# EAGLE design CSPB (EAGLE 9.5.1)

## Sheet 1 of 2
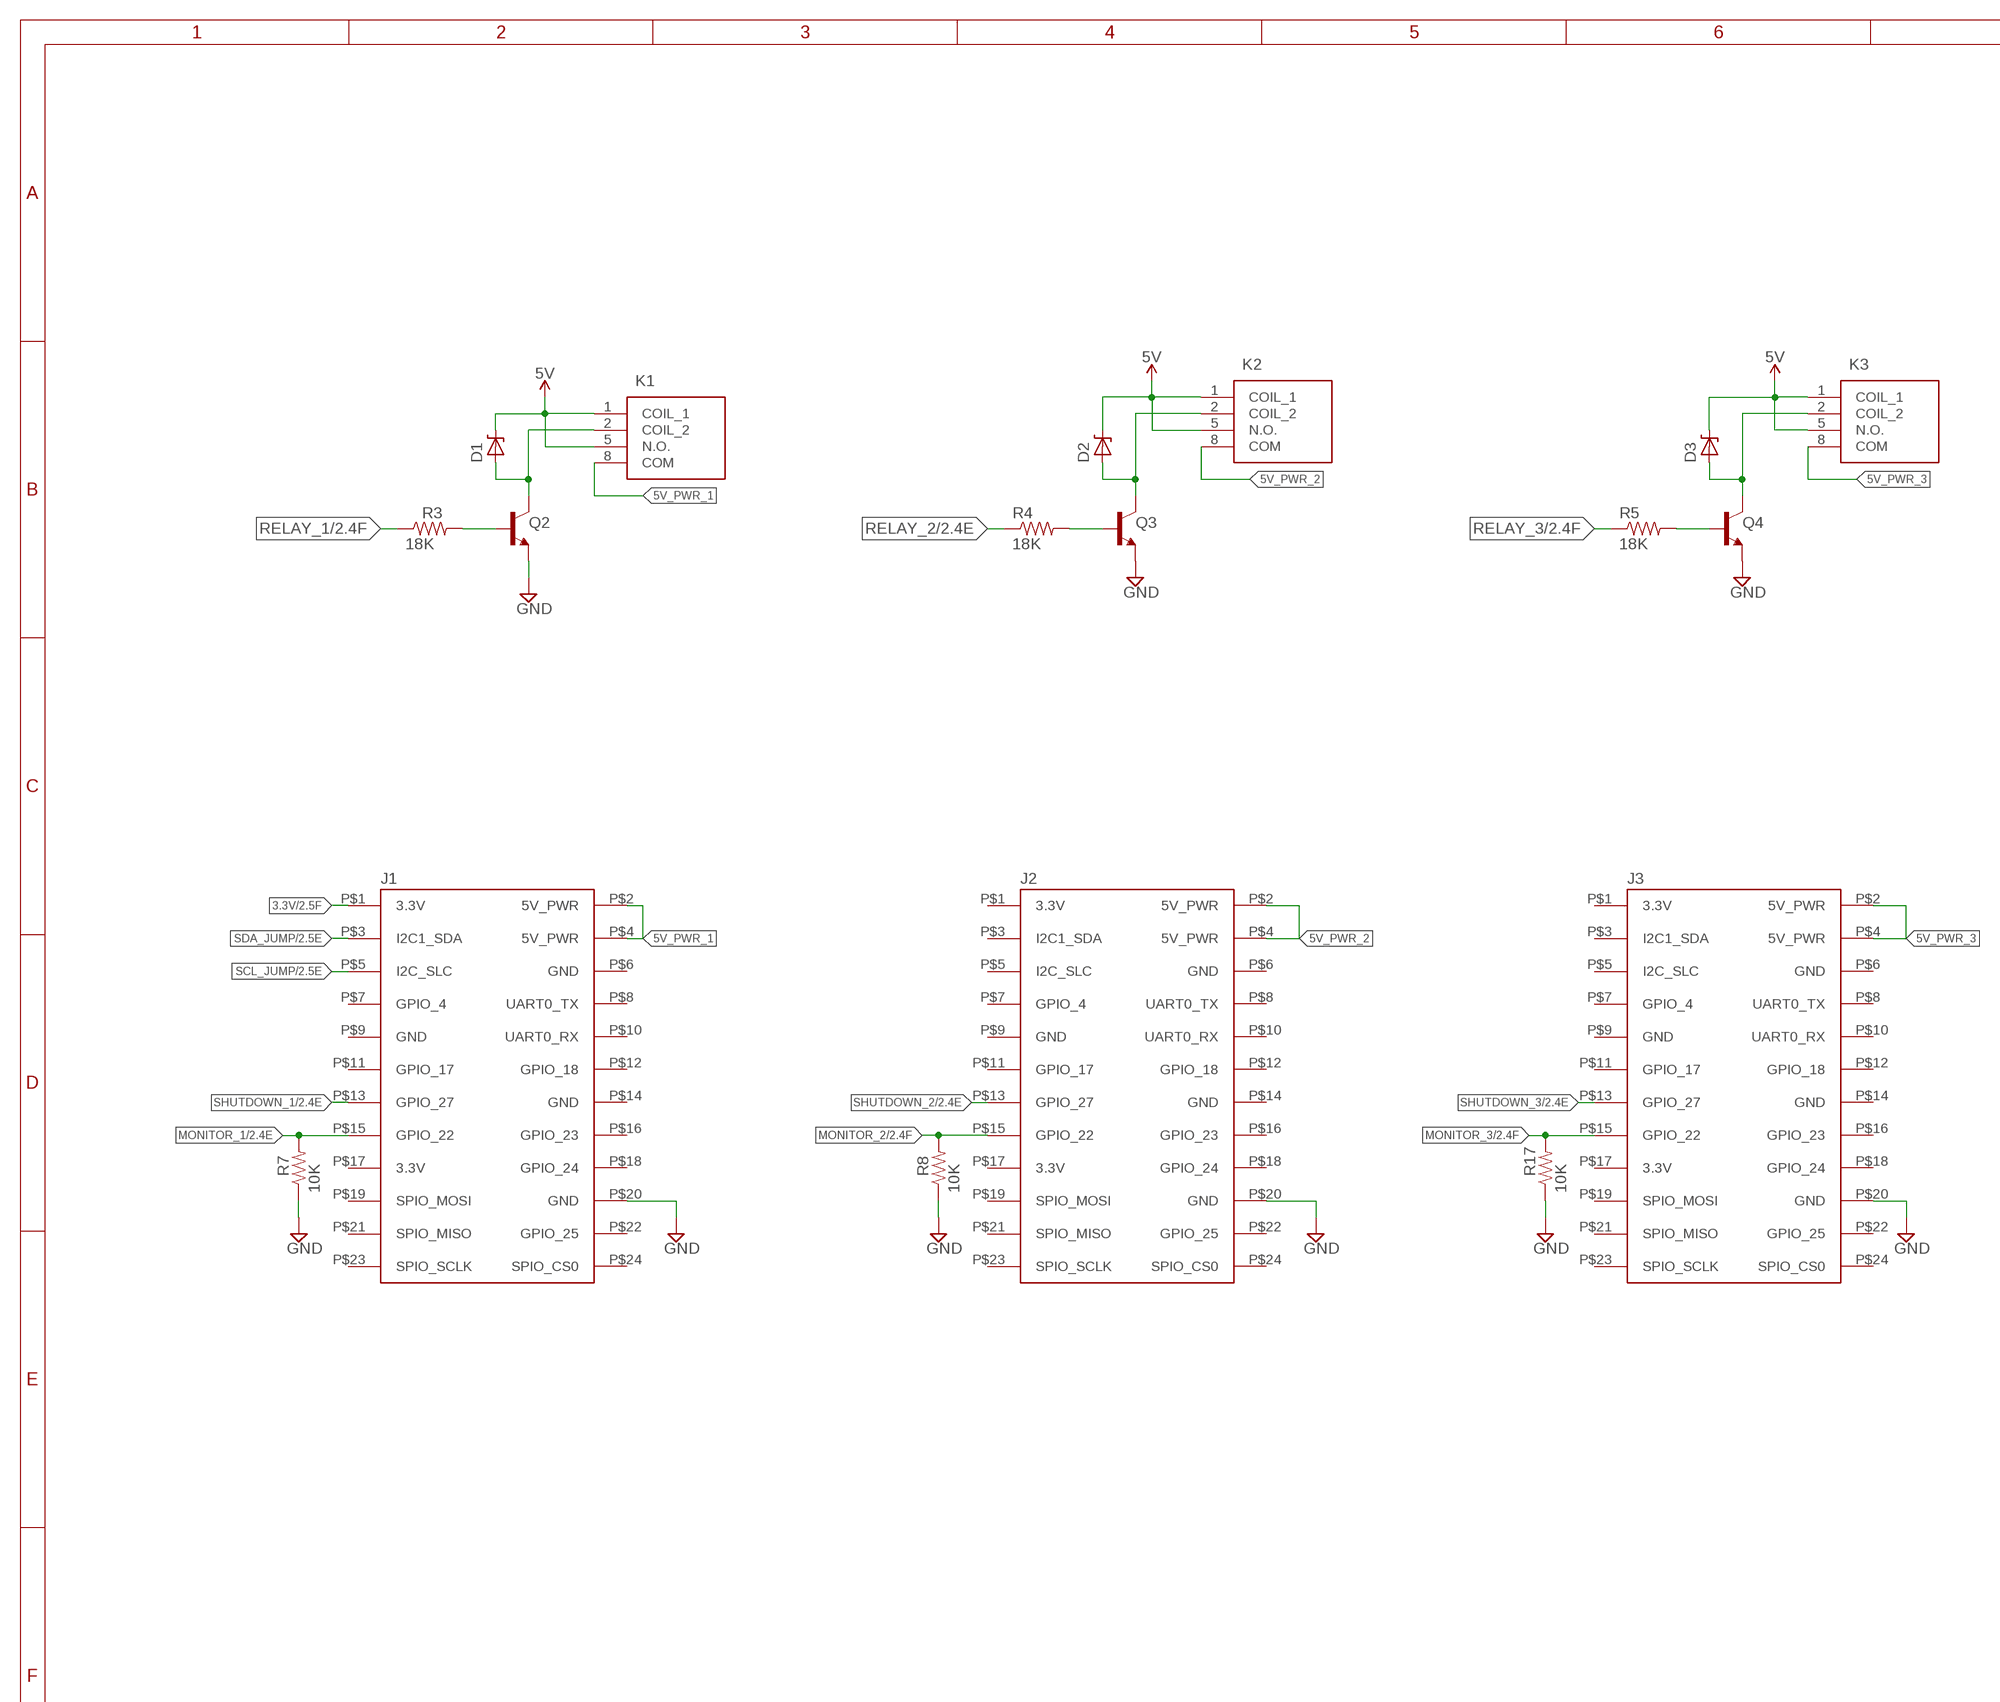
[diagram p0: schematic, sheet 1, part 1 of 2]
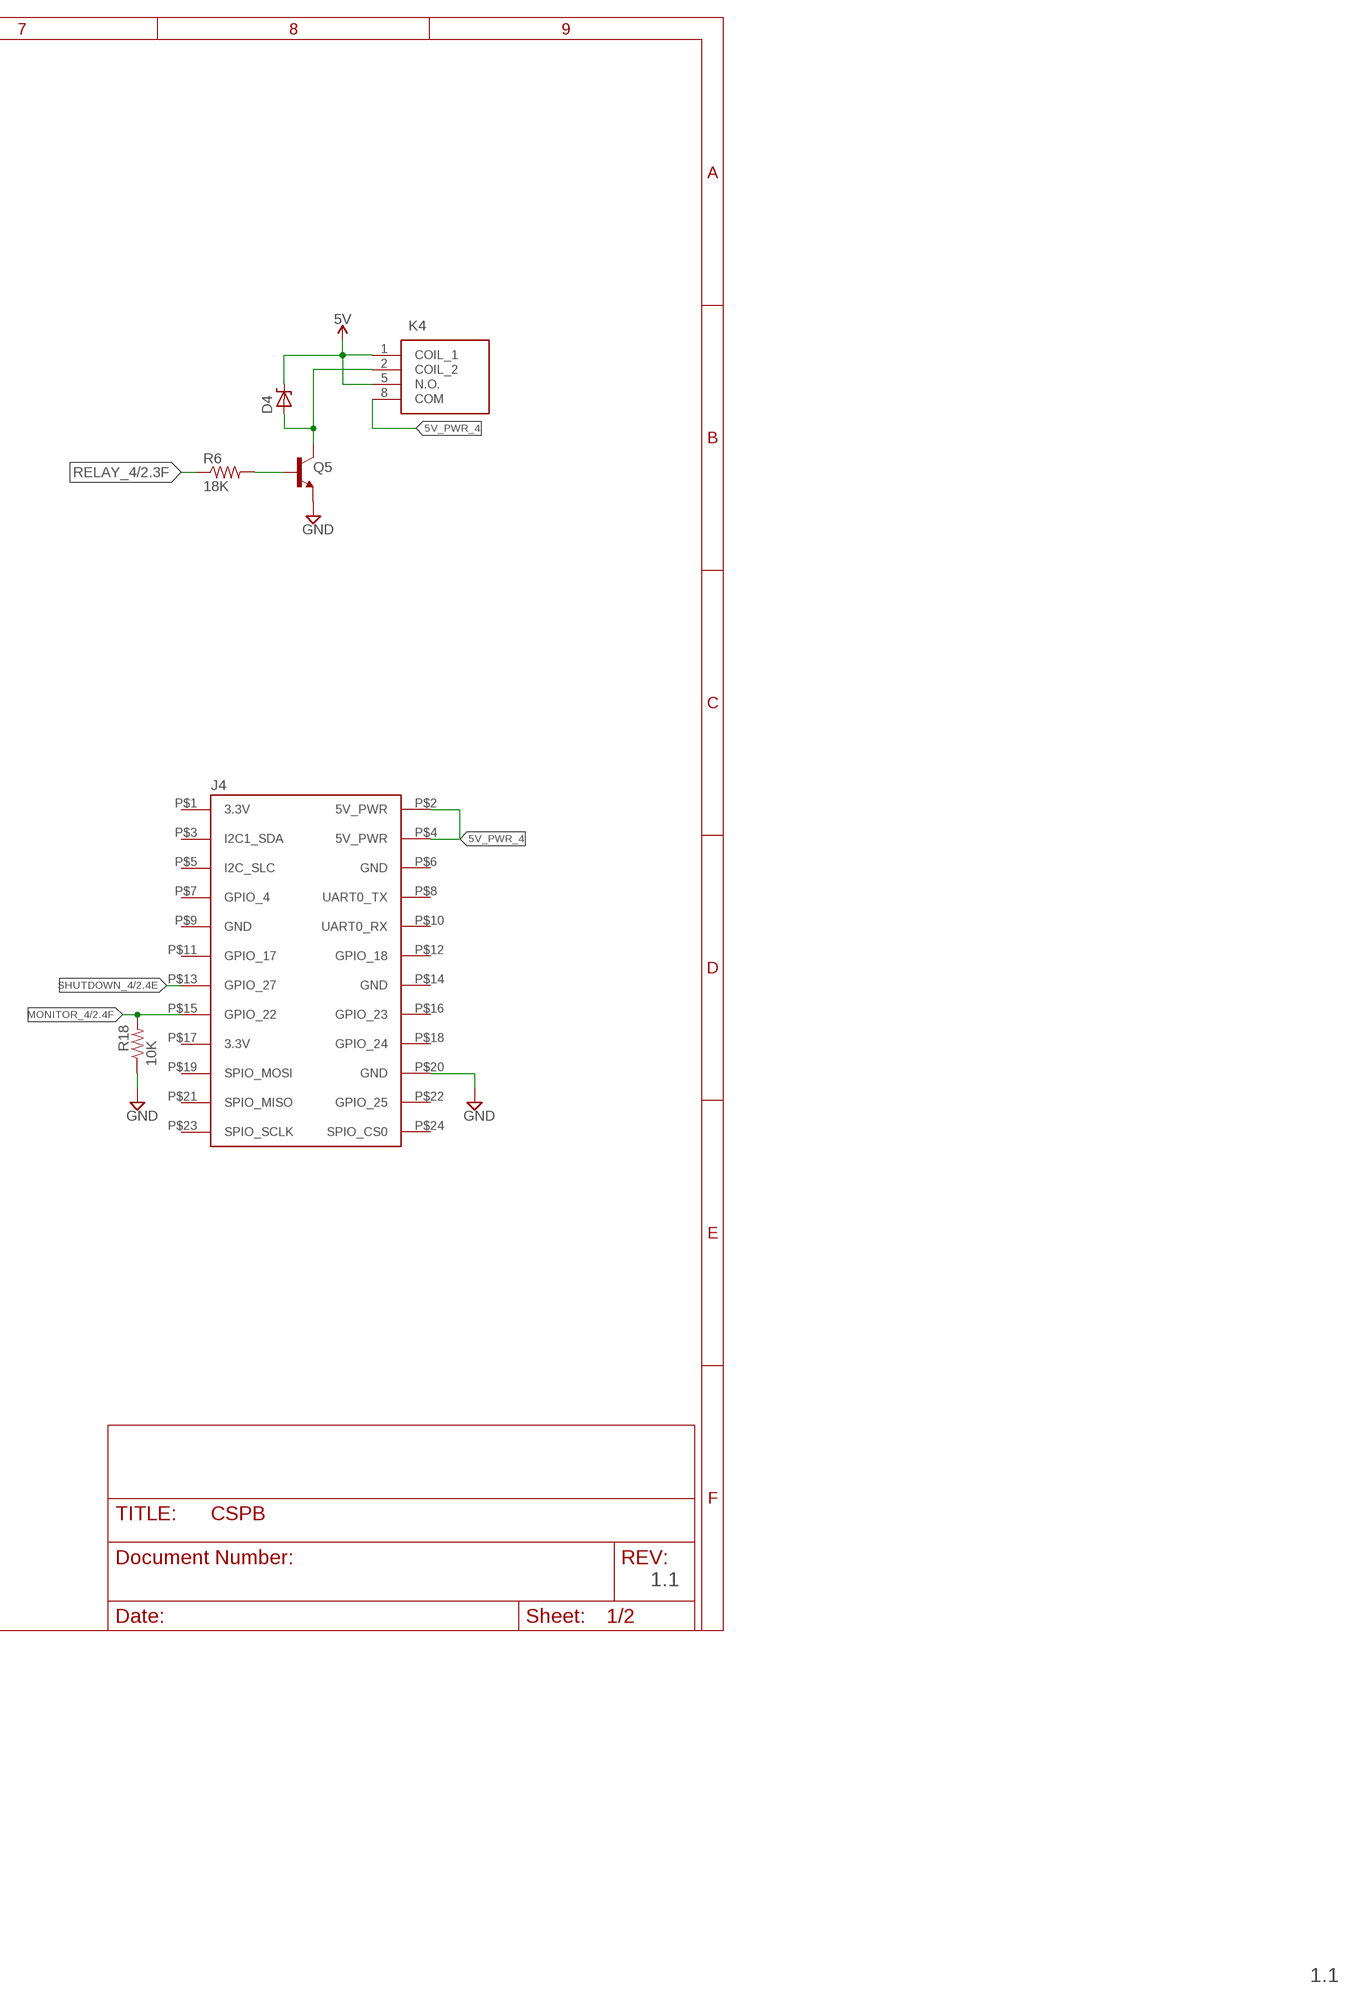
[diagram p1: schematic, sheet 1, part 2 of 2]

### Parts
D1  1A/23V/620mV  DIODE-ZENER  [SMADIODE]
D2  1A/23V/620mV  DIODE-ZENER  [SMADIODE]
D3  1A/23V/620mV  DIODE-ZENER  [SMADIODE]
D4  1A/23V/620mV  DIODE-ZENER  [SMADIODE]
J1  5530843-1  [2X12_TH_EDGE_CONN]
J2  5530843-1  [2X12_TH_EDGE_CONN]
J3  5530843-1  [2X12_TH_EDGE_CONN]
J4  5530843-1  [2X12_TH_EDGE_CONN]
K1  G6DN-1A_DC5  [G6DN-1A-L]
K2  G6DN-1A_DC5  [G6DN-1A-L]
K3  G6DN-1A_DC5  [G6DN-1A-L]
K4  G6DN-1A_DC5  [G6DN-1A-L]
Q2  600mA/40V  TRANS_NPN-MMBT2222AL  [SOT23-3]
Q3  600mA/40V  TRANS_NPN-MMBT2222AL  [SOT23-3]
Q4  600mA/40V  TRANS_NPN-MMBT2222AL  [SOT23-3]
Q5  600mA/40V  TRANS_NPN-MMBT2222AL  [SOT23-3]
R3  18K  RESISTOR0603-RES  [0603-RES]
R4  18K  RESISTOR0603-RES  [0603-RES]
R5  18K  RESISTOR0603-RES  [0603-RES]
R6  18K  RESISTOR0603-RES  [0603-RES]
R7  10K  RESISTOR0603-RES  [0603-RES]
R8  10K  RESISTOR0603-RES  [0603-RES]
R17  10K  RESISTOR0603-RES  [0603-RES]
R18  10K  RESISTOR0603-RES  [0603-RES]

### Nets
3.3V: J1.P$1(3.3V) ; also sheet 2
5V: D1.C D2.C D3.C D4.C K1.1(COIL_1) K1.5(N.O.) K2.1(COIL_1) K2.5(N.O.) K3.1(COIL_1) K3.5(N.O.) K4.1(COIL_1) K4.5(N.O.) ; also sheet 2
5V_PWR_1: J1.P$2(5V_PWR) J1.P$4(5V_PWR) K1.8(COM)
5V_PWR_2: J2.P$2(5V_PWR) J2.P$4(5V_PWR) K2.8(COM)
5V_PWR_3: J3.P$2(5V_PWR) J3.P$4(5V_PWR) K3.8(COM)
5V_PWR_4: J4.P$2(5V_PWR) J4.P$4(5V_PWR) K4.8(COM)
GND: J1.P$20(GND) J2.P$20(GND) J3.P$20(GND) J4.P$20(GND) Q2.2(E) Q3.2(E) Q4.2(E) Q5.2(E) R7.1 R8.1 R17.1 R18.1 ; also sheet 2
MONITOR_1: J1.P$15(GPIO_22) R7.2 ; also sheet 2
MONITOR_2: J2.P$15(GPIO_22) R8.2 ; also sheet 2
MONITOR_3: J3.P$15(GPIO_22) R17.2 ; also sheet 2
MONITOR_4: J4.P$15(GPIO_22) R18.2 ; also sheet 2
N$3: Q2.1(B) R3.2
N$4: D1.A K1.2(COIL_2) Q2.3(C)
N$5: Q4.1(B) R5.2
N$8: Q5.1(B) R6.2
N$16: D2.A K2.2(COIL_2) Q3.3(C)
N$21: D3.A K3.2(COIL_2) Q4.3(C)
N$22: D4.A K4.2(COIL_2) Q5.3(C)
N$35: Q3.1(B) R4.2
RELAY_1: R3.1 ; also sheet 2
RELAY_2: R4.1 ; also sheet 2
RELAY_3: R5.1 ; also sheet 2
RELAY_4: R6.1 ; also sheet 2
SCL_JUMP: J1.P$5(I2C_SLC) ; also sheet 2
SDA_JUMP: J1.P$3(I2C1_SDA) ; also sheet 2
SHUTDOWN_1: J1.P$13(GPIO_27) ; also sheet 2
SHUTDOWN_2: J2.P$13(GPIO_27) ; also sheet 2
SHUTDOWN_3: J3.P$13(GPIO_27) ; also sheet 2
SHUTDOWN_4: J4.P$13(GPIO_27) ; also sheet 2
Unconnected: J1.P$7(GPIO_4) J1.P$8(UART0_TX) J1.P$10(UART0_RX) J1.P$11(GPIO_17) J1.P$12(GPIO_18) J1.P$16(GPIO_23) J1.P$17(3.3V) J1.P$18(GPIO_24) J1.P$19(SPIO_MOSI) J1.P$21(SPIO_MISO) J1.P$22(GPIO_25) J1.P$23(SPIO_SCLK) J1.P$24(SPIO_CS0) J2.P$1(3.3V) J2.P$3(I2C1_SDA) J2.P$5(I2C_SLC) J2.P$7(GPIO_4) J2.P$8(UART0_TX) J2.P$10(UART0_RX) J2.P$11(GPIO_17) J2.P$12(GPIO_18) J2.P$16(GPIO_23) J2.P$17(3.3V) J2.P$18(GPIO_24) J2.P$19(SPIO_MOSI) J2.P$21(SPIO_MISO) J2.P$22(GPIO_25) J2.P$23(SPIO_SCLK) J2.P$24(SPIO_CS0) J3.P$1(3.3V) J3.P$3(I2C1_SDA) J3.P$5(I2C_SLC) J3.P$7(GPIO_4) J3.P$8(UART0_TX) J3.P$10(UART0_RX) J3.P$11(GPIO_17) J3.P$12(GPIO_18) J3.P$16(GPIO_23) J3.P$17(3.3V) J3.P$18(GPIO_24) J3.P$19(SPIO_MOSI) J3.P$21(SPIO_MISO) J3.P$22(GPIO_25) J3.P$23(SPIO_SCLK) J3.P$24(SPIO_CS0) J4.P$1(3.3V) J4.P$3(I2C1_SDA) J4.P$5(I2C_SLC) J4.P$7(GPIO_4) J4.P$8(UART0_TX) J4.P$10(UART0_RX) J4.P$11(GPIO_17) J4.P$12(GPIO_18) J4.P$16(GPIO_23) J4.P$17(3.3V) J4.P$18(GPIO_24) J4.P$19(SPIO_MOSI) J4.P$21(SPIO_MISO) J4.P$22(GPIO_25) J4.P$23(SPIO_SCLK) J4.P$24(SPIO_CS0)

### Notes on the sheet
- 1.1
- 1.1

## Sheet 2 of 2
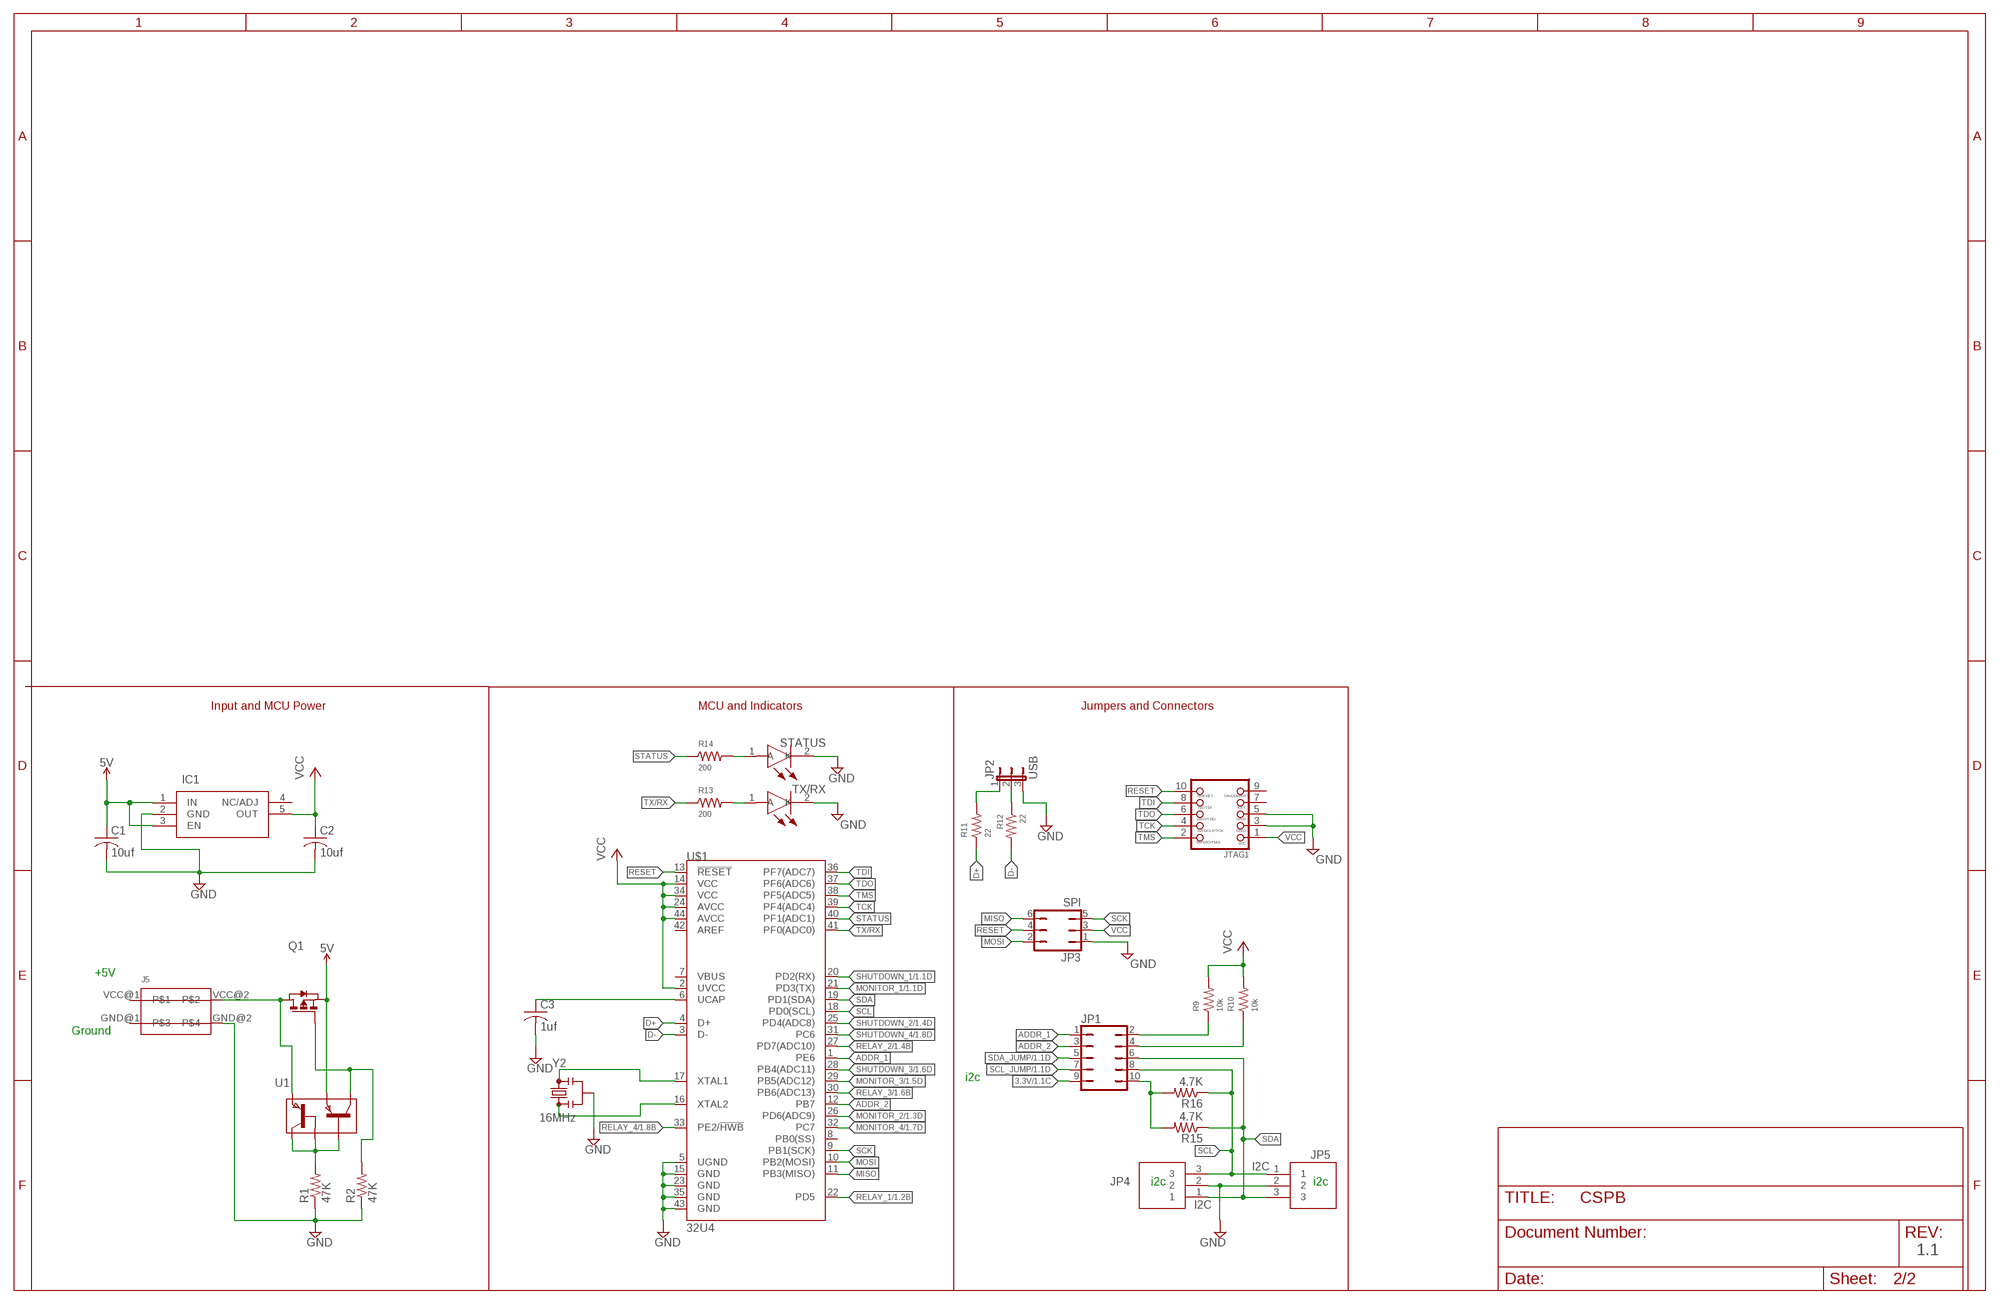
[diagram p2: schematic, sheet 2]

### Parts
C1  10uf  C-USC1206  [C1206]
C2  10uf  C-USC1206  [C1206]
C3  1uf  C-USC1206  [C1206]
IC1  MIC5225-5.0YM5-TR  [SOT95P280X130-5N]
J5  182442000  [TB-2-POS-3_5MM-PITCH]
JP1  JP5Q  [JP5Q]
JP2  USB  JUMPER3  [JUMPER3]
JP3  SPI  JP3Q  [JP3Q]
JP4  I2C  S3B-PH-K-S_LF__SN_  [SHDRRA3W50P0X200_1X3_790X760X4]
JP5  I2C  S3B-PH-K-S_LF__SN_  [SHDRRA3W50P0X200_1X3_790X760X4]
JTAG1  JTAG-CORTEXM3MOLEX  [CORTEXM3_SWD10_MOLEX]
Q1  SQM40081EL  [TO-263AB]
R1  47K  RESISTOR1206  [1206]
R2  47K  RESISTOR1206  [1206]
R9  10k  RESISTOR0402-RES  [0402-RES]
R10  10k  RESISTOR0402-RES  [0402-RES]
R11  22  RESISTOR0402-RES  [0402-RES]
R12  22  RESISTOR0402-RES  [0402-RES]
R13  200  RESISTOR0805-RES  [0805]
R14  200  RESISTOR0805-RES  [0805]
R15  4.7K  RESISTOR0603-RES  [0603-RES]
R16  4.7K  RESISTOR0603-RES  [0603-RES]
STATUS  LTST-S220KGKT  [LTSTS220KGKT]
TX/RX  LTST-S220KRKT  [LTSTS220KGKT]
U1  DMMT5401-7-F  [SOT26-PNP]
U$1  32U4  ATMEGA32U4QFN  [QFN-44]
Y2  16MHz  RESONATOR-16MHZSMD_3.2X1.3  [RESONATOR-SMD-3.2X1.3]

### Nets
3.3V: JP1.9 ; also sheet 1
5V: C1.1 IC1.1(IN) IC1.3(EN) Q1.3(S) U1.E2(E1) ; also sheet 1
ADDR_1: JP1.1 U$1.1(PE6)
ADDR_2: JP1.3 U$1.12(PB7)
D+: R11.1 U$1.4(D+)
D-: R12.2 U$1.3(D-)
GND: C1.2 C2.2 C3.2 IC1.2(GND) J5.GND@2 JP2.3 JP3.1 JP4.2 JP5.2 JTAG1.3 JTAG1.5 R1.1 R2.1 STATUS.2(K) TX/RX.2(K) U$1.5(UGND) U$1.15(GND) U$1.23(GND) U$1.35(GND) U$1.43(GND) Y2.2 ; also sheet 1
MISO: JP3.6 U$1.11(PB3(MISO))
MONITOR_1: U$1.21(PD3(TX)) ; also sheet 1
MONITOR_2: U$1.26(PD6(ADC9)) ; also sheet 1
MONITOR_3: U$1.29(PB5(ADC12)) ; also sheet 1
MONITOR_4: U$1.32(PC7) ; also sheet 1
MOSI: JP3.2 U$1.10(PB2(MOSI))
N$1: C3.1 U$1.6(UCAP)
N$2: R14.2 STATUS.1(A)
N$6: R13.2 TX/RX.1(A)
N$10: JP1.10 R15.2 R16.2
N$11: R1.2 U1.B1(B) U1.B2(B1) U1.C1(C)
N$15: Q1.1(G) R2.2 U1.C2(C1)
N$18: JP1.2 R9.1
N$19: JP1.4 R10.1
N$36: JP2.1 R11.2
N$38: JP2.2 R12.1
RELAY_1: U$1.22(PD5) ; also sheet 1
RELAY_2: U$1.27(PD7(ADC10)) ; also sheet 1
RELAY_3: U$1.30(PB6(ADC13)) ; also sheet 1
RELAY_4: U$1.33(PE2/!HWB) ; also sheet 1
RESET: JP3.4 JTAG1.10 U$1.13(!RESET)
SCK: JP3.5 U$1.9(PB1(SCK))
SCL: JP1.8 JP4.3 JP5.1 R16.1 U$1.18(PD0(SCL))
SCL_JUMP: JP1.7 ; also sheet 1
SDA: JP1.6 JP4.1 JP5.3 R15.1 U$1.19(PD1(SDA))
SDA_JUMP: JP1.5 ; also sheet 1
SHUTDOWN_1: U$1.20(PD2(RX)) ; also sheet 1
SHUTDOWN_2: U$1.25(PD4(ADC8)) ; also sheet 1
SHUTDOWN_3: U$1.28(PB4(ADC11)) ; also sheet 1
SHUTDOWN_4: U$1.31(PC6) ; also sheet 1
STATUS: R14.1 U$1.40(PF1(ADC1))
TCK: JTAG1.4 U$1.39(PF4(ADC4))
TDI: JTAG1.8 U$1.36(PF7(ADC7))
TDO: JTAG1.6 U$1.37(PF6(ADC6))
TMS: JTAG1.2 U$1.38(PF5(ADC5))
TX/RX: R13.1 U$1.41(PF0(ADC0))
VCC: C2.1 IC1.5(OUT) JP3.3 JTAG1.1 R9.2 R10.2 U$1.2(UVCC) U$1.14(VCC) U$1.24(AVCC) U$1.34(VCC) U$1.44(AVCC)
VCC_IN: J5.VCC@2 Q1.2(D) U1.E1(E)
XTAL1: U$1.17(XTAL1) Y2.3
XTAL2: U$1.16(XTAL2) Y2.1
Unconnected: IC1.4(NC/ADJ) JTAG1.7 JTAG1.9 U$1.7(VBUS) U$1.8(PB0(SS)) U$1.42(AREF)

### Notes on the sheet
- Input and MCU Power | MCU and Indicators | Jumpers and Connectors
- +5V
- Ground
- i2c
- i2c | i2c
- 1.1

## Power pins joined to a net without a drawn wire
GND: J1.P$6(GND) J1.P$9(GND) J1.P$14(GND) J2.P$6(GND) J2.P$9(GND) J2.P$14(GND) J3.P$6(GND) J3.P$9(GND) J3.P$14(GND) J4.P$6(GND) J4.P$9(GND) J4.P$14(GND)
P$1: J5.VCC@1
P$3: J5.GND@1

## Library data of the parts
C1-C3 = adafruit:C-US: CAPACITOR, American symbol
D1-D4 = microbuilder:DIODE-ZENER: Zener Diode SMA: 30V 1W Zener Diode, 1.2Vf - Digikey: SMAZ30-FDICT-ND
IC1 = MIC5225-5.0YM5-TR:MIC5225-5.0YM5-TR: MICROCHIP - MIC5225-5.0YM5-TR - LDO VOLT REG, 0.15A, 5V, SOT-23-5 Source: Datasheet <http://ww1.microchip.com/downloads/en/DeviceDoc/mic5225.pdf>
J1-J4 = Jerry-Master-Lib:5530843-1: TE Connectivity AMP 5530843-1 CONN SEC II 12 POS 100C/L Datasheet <http://www.mouser.com/ds/2/418/NG_CD_5530843_F8-681518.pdf> Mouser <http://www.mouser.com/ProductDetail/TE-Connectivity/5530843-1/?qs=%2fha2pyFadujzP4%252bTtTPj73W%2fSw4seCDq6IiciaeyAVc%3d> Digi-key <http://www.digikey.com/product-search/en?keywords=5530843-1>
J5 = Jerry-Master-Lib:182442000: WEIDMULLER 1824420000 Wire-To-Board Terminal Block, 2 Positions, 320 V, 17.5 A, 24 AWG, 16 AWG, 1.5 mm Tall Datasheet <http://www.farnell.com/datasheets/1810949.pdf> OnlineComponents <http://www.onlinecomponents.com/keywordsearch.aspx?text=WEIDMULLER%201824420000> Newark <http://www.newark.com/weidmuller/1824420000/terminal-block-2-contacts-24-16/dp/21M0663?ost=1824420000&selectedCategoryId=&categoryNameResp=All%2BCategories&iscrfnonsku=false> Digi-key <http://www.digikey.com/product-search/en?keywords=1824420000>; SPICEPREFIX: E
JP1 = jumper:JP5Q: JUMPER
JP2 = microbuilder:JUMPER3: JUMPER - 3 Pins
JP3 = jumper:JP3Q: JUMPER
JP4 JP5 = S3B-PH-K-S_LF__SN_:S3B-PH-K-S_LF__SN_: PH-2.0mm Header side entry 3 way JST PH Series, Series Number S3B, 2mm Pitch 3 Way 1 Row Shrouded Right Angle PCB Header, Through Hole Source: Datasheet <http://www.jst-mfg.com/product/pdf/eng/ePH.pdf>
JTAG1 = microbuilder:JTAG-CORTEXM3: Serial Wire (SW-DP) Connector This standard 0.05" 10-pin connector is for use with the Cortex M0/M3's native SWD (serial wire debugger) interface (SW-DP). Some boards support a 20-pin combined JTAG+SWD connector (SWJ-DP), such as the LPC1700 family, but many smaller devices only work with SWD which typically use the smaller 10-pin SW-DP connecter (the LPC1300 family, for example, only supports SWD). 2x05 1.27mm/0.05" Connector: This is the standard SMT connector defined by ARM for all Cortex devices, and should be used in most situations and for forward-compatibility since any new devices coming to market will likely use this connector. MOLEX 10 Pin 0.1" Connector: This 0.1" 10 pin connector has the same pin layout as the standard 0.05" connector, but is easier to work with if you are using standard jumper wires or custom cables to connect your SWD hardware. MOLEX 20 Pin 0.1" Connector: This 0.1" 20 pin connector is the same model used for ARM7/ARM9 JTAG debuggers, but is connected to match the pins on the Segger J-Link for ARM (which supports both JTAG and SWD debugging). See the following document from ARM for more information on Cortex M3 Debug Connectors: http://infocenter.arm.com/help/topic/com.arm.doc.faqs/attached/13634/cortex_debug_connectors.pdf And the following page for an overview with images of the different connector types: http://www.keil.com/peripherals/coresight/connectors.asp
K1-K4 = G6DN-1A_DC5:G6DN-1A_DC5: OMRON ELECTRONIC COMPONENTS - G6DN-1A DC5 - RELAY, 5VDC, 5A, SPST-NO, THT Source: Datasheet <https://omronfs.omron.com/en_US/ecb/products/pdf/en-g6dn.pdf>
Q1 = Jerry-Master-Lib:SQM40081EL: SQM40081EL Vishay Datasheet <http://www.farnell.com/datasheets/2786217.pdf> Newark <https://www.newark.com/vishay/sqm40081el-ge3/mosfet-aec-q101-p-ch-40v-50a-107w/dp/99AC9600?ost=sqm40081el#anchorTechnicalDOCS> Digi-key <https://www.digikey.com/en/products/detail/vishay-siliconix/SQM40081EL_GE3/9818527?s=N4IgTCBcDaIM4EcC2AWADGgHARgKYBsQBdAXyA> Mouser <https://www.mouser.com/ProductDetail/Vishay-Siliconix/SQM40081EL_GE3/?qs=%2Fha2pyFadujrhQ%252Bzk0bdCctnXqiQv7HZgMECeZdR9KW%252BEKsvqbVMKg%3D%3D>; SPICEPREFIX: Q
Q2-Q5 = SparkFun-DiscreteSemi:TRANS_NPN: NPN transistor Current controlled devices typically used to amplify current or used as a switch. BC547 - COM-08928 <http://www.sparkfun.com/products/8928> (TO-92 45V 100mA) (1.Collector 2.Base 3.Emitter) 2N3904 - COM-00521 <http://www.sparkfun.com/products/521> (TO-92 40V 200mA) (1.Emitter 2.Base 3.Collector) P2N2222A - COM-12852 <http://www.sparkfun.com/products/12852> (TO-92 40V 600mA) (1.Collector 2.Base 3.Emitter); PROD_ID: TRANS-08049
R1 R2 R13 R14 = SparkFun:RESISTOR: Resistor Basic schematic elements and footprints for 0603, 1206, and PTH resistors.; SPICEPREFIX: R
R3-R12 R15-R18 = SparkFun:RESISTOR: Resistor Basic schematic elements and footprints for 0603, 1206, and PTH resistors.
STATUS = LTST-S220KGKT:LTST-S220KGKT: LTST-S220KGKT, Lite-On 571 nm Green LED, 2012 (0805) Side View SMD package Source: Datasheet <https://optoelectronics.liteon.com/upload/download/DS22-2000-075/LTST-S220KGKT.pdf>
TX/RX = LTST-S220KGKT:LTST-S220KRKT: LTST-S220KRKT, Lite-On 571 nm Red LED, 2012 (0805) Side View SMD package Source: Datasheet <https://optoelectronics.liteon.com/upload/download/DS22-2000-137/LTST-S220KRKT.pdf>
U1 = Jerry-Master-Lib:DMMT5401-7-F: Diodes Incorporated DMMT5401-7-F TRANS 2PNP 150V 0.2A SOT26 Package: SOT23 Data Sheet <http://www.diodes.com/_files/datasheets/ds30437.pdf> Digi-Key DMMT5401-FDICT-ND <http://www.digikey.com/product-detail/en/diodes-incorporated/DMMT5401-7-F/DMMT5401-FDICT-ND/717881> Newark 51R6458 <http://www.newark.com/diodes-inc/dmmt5401-7-f/transistor-matched-pnp-pnp-sot26/dp/51R6458?ost=DMMT5401-7-F&selectedCategoryId=&categoryNameResp=All%2BCategories&iscrfnonsku=false>; SPICEPREFIX: X
U$1 = SparkFun-IC-Microcontroller:ATMEGA32U4: Atmel MCU, 32KByte Atmel 44-pin 8-bit Microcontroller with 32KBytes of ISP Flash and USB Controller Datasheet <http://cdn.sparkfun.com/datasheets/Dev/Arduino/Boards/ATMega32U4.pdf> SparkFun Products LilyPad Arduino USB - ATmega32U4 Board <https://www.sparkfun.com/products/12049> (DEV-12049) Pro Micro - 5V/16MHz <https://www.sparkfun.com/products/12640> (DEV-12640) Pro Micro - 3.3V/8MHz <https://www.sparkfun.com/products/12587> (DEV-12587) Fio v3 - ATmega32U4 <https://www.sparkfun.com/products/11520> (DEV-11520) Qduino Mini <https://www.sparkfun.com/products/13614> (DEV-13614) Makey Makey - Standard Kit <https://www.sparkfun.com/products/11511> (WIG-11511) Makey Makey Deluxe Kit <https://www.sparkfun.com/products/11519> (WIG-11519)
Y2 = SparkFun-Clocks:RESONATOR-16MHZ: 16MHz Resonator Digikey Example <http://www.digikey.com/product-detail/en/murata-electronics-north-america/CSTCE16M0V53-R0/490-1198-1-ND/584635> Frequency: 16MHz Frequency Stability: ±0.3% Frequency Tolerance: ±0.5% Capacitance: 15pF SparkFun Products SparkFun OpenLog <https://www.sparkfun.com/products/13712> SparkFun MicroView - OLED Arduino Module <https://www.sparkfun.com/products/12923>; PROD_ID: XTAL-08900

## Net classes
0 default: clearance 0.205 mm

## Board
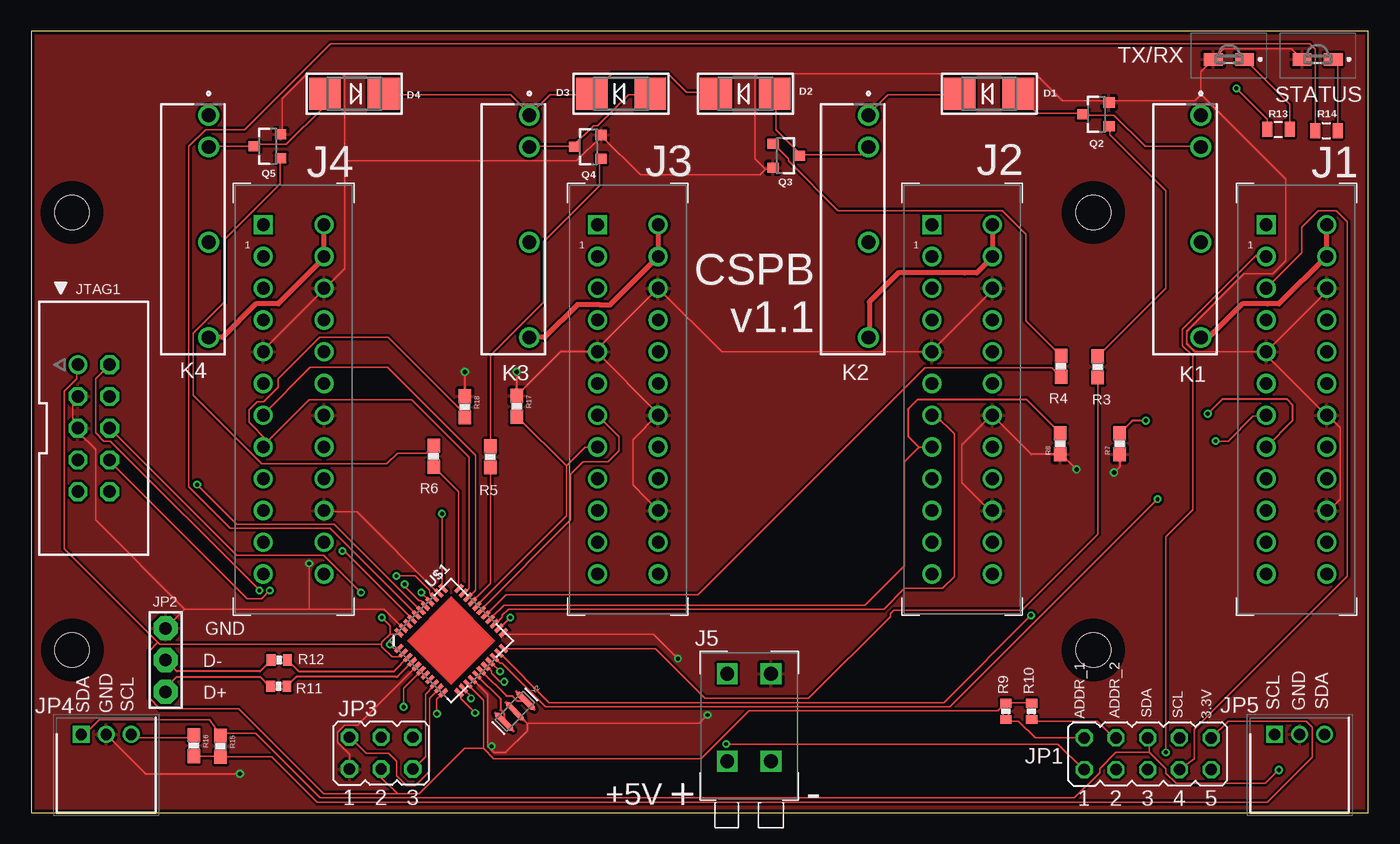
[diagram p3: board, top side]
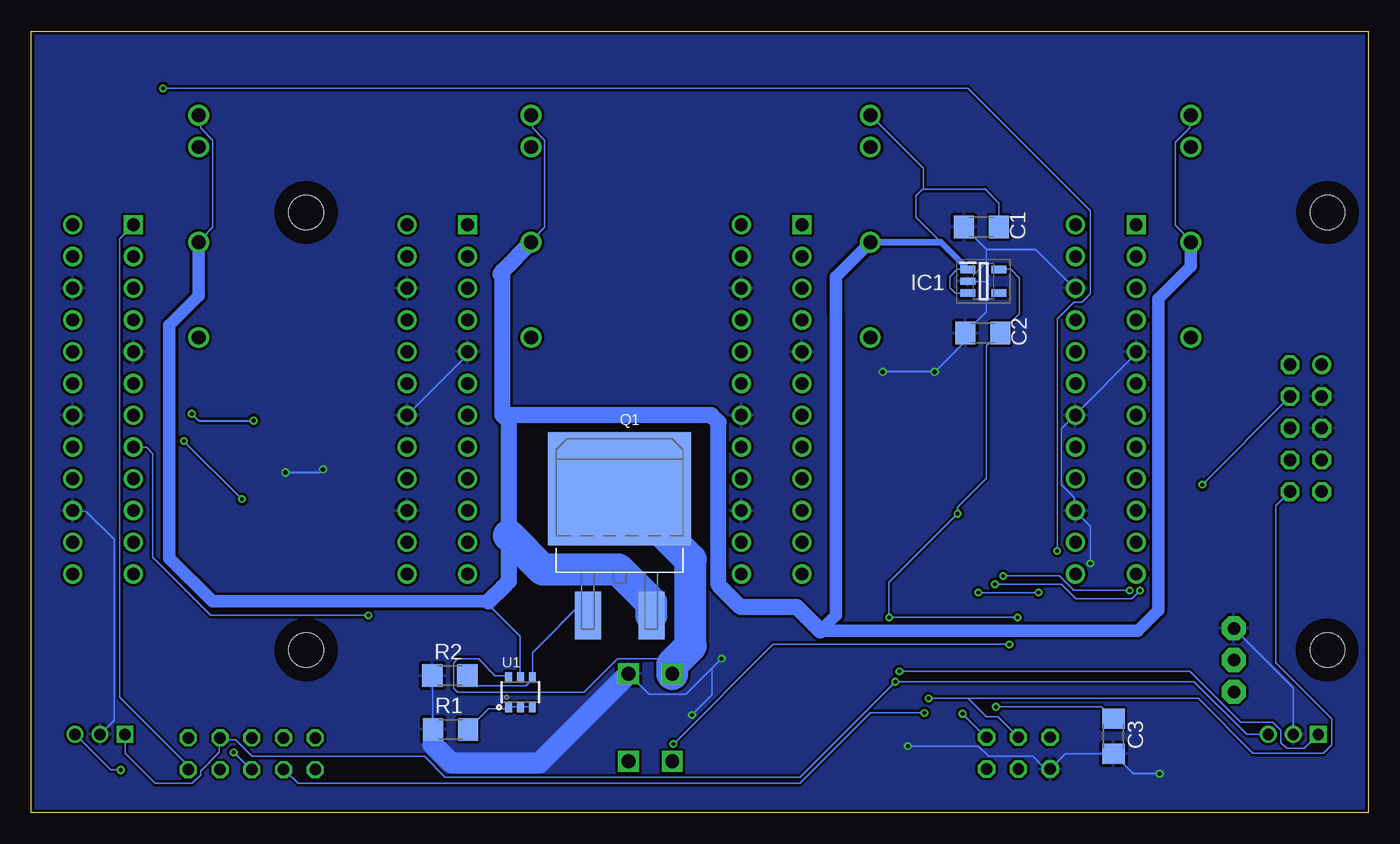
[diagram p4: board, bottom side, seen from below]

Size 107 x 62.5 mm. Coordinates in mm from the lower left corner, seen from the top.
Outline: 107,0 107,62.5 0,62.5 0,0 107,0
Copper layers (1*16): Top 0.035mm / dielectric 1.5mm / Bottom 0.035mm
Design rules "MF_Standard_2_Layer": minimum track width 5mil, minimum drill 12mil, track to track 5mil, track to pad 5mil, pad to pad 5mil, via to via 5mil, smd to smd 0mil, copper to edge 10mil, drill to drill 10mil, minimum pad ring 6mil, minimum via ring 6mil, stop-mask expansion 2mil, vias tented up to drill 25mil, thermal gap 10mil
Holes 2.75 mm at 3.25,13 3.25,48 85,13 85,48
tRestrict: area 83,11 to 87,15; area 83,46 to 87,50; area 1.2,46 to 5.2,50; area 1.3,11 to 5.3,15
bRestrict: area 83,46 to 87,50; area 1.3,11 to 5.3,15; area 83,11 to 87,15; area 1.2,46 to 5.2,50

### Footprints (pad centres in the part's own frame; a part is rotated, then mirrored left to right if it is on the bottom)
C1206 = smd 1.6 x 1.8: 1 -1.4,0; 2 1.4,0
SMADIODE = smd 2.54 x 2.54: A 2.349,0; C -2.349,0
SOT95P280X130-5N = smd 1.2 x 0.6: 1 -1.25,0.95; 2 -1.25,0; 3 -1.25,-0.95; 4 1.25,-0.95; 5 1.25,0.95
2X12_TH_EDGE_CONN = drill 1.016 square: P$1 -2.426,13.97 | drill 1.016: P$2 2.426,13.97; P$3 -2.426,11.43; P$4 2.426,11.43; P$5 -2.426,8.89; P$6 2.426,8.89; P$7 -2.426,6.35; P$8 2.426,6.35; P$9 -2.426,3.81; P$10 2.426,3.81; P$11 -2.426,1.27; P$12 2.426,1.27; P$13 -2.426,-1.271; P$14 2.426,-1.27; P$15 -2.426,-3.81; P$16 2.426,-3.81; P$17 -2.426,-6.35; P$18 2.426,-6.35; P$19 -2.426,-8.89; P$20 2.426,-8.89; P$21 -2.426,-11.43; P$22 2.426,-11.43; P$23 -2.426,-13.97; P$24 2.426,-13.97
TB-2-POS-3_5MM-PITCH = drill 1.1 square: GND@1 1.7,-3.2; GND@2 1.7,3.8; VCC@1 -1.8,-3.2; VCC@2 -1.8,3.8
JP5Q = drill 0.914 octagon: 1 -5.08,-1.27; 2 -5.08,1.27; 3 -2.54,-1.27; 4 -2.54,1.27; 5 0,-1.27; 6 0,1.27; 7 2.54,-1.27; 8 2.54,1.27; 9 5.08,-1.27; 10 5.08,1.27
JUMPER3 = drill 1 pad 1.93 octagon: 1 -2.54,0; 2 0,0; 3 2.54,0
JP3Q = drill 0.914 octagon: 1 -2.54,-1.27; 2 -2.54,1.27; 3 0,-1.27; 4 0,1.27; 5 2.54,-1.27; 6 2.54,1.27
SHDRRA3W50P0X200_1X3_790X760X4 = drill 0.9 pad 1.35 square: 1 0,0 | drill 0.9 pad 1.35: 2 -2,0; 3 -4,0
CORTEXM3_SWD10_MOLEX = drill 1: 1 -5.08,-1.27 | drill 1 octagon: 2 -5.08,1.27; 3 -2.54,-1.27; 4 -2.54,1.27; 5 0,-1.27; 6 0,1.27; 7 2.54,-1.27; 8 2.54,1.27; 9 5.08,-1.27; 10 5.08,1.27
G6DN-1A-L = drill 1.1 pad 1.65: 1 -17.78,0; 2 -15.24,0; 5 -7.62,0; 8 0,0
TO-263AB = smd 2.08 x 3.8: 1 -2.54,-6.4; 3 2.54,-6.4 | smd 11.43 x 9.05: 2 0,3.75
SOT23-3 = smd 0.8 x 0.9: 1 -0.95,-1; 2 0.95,-1; 3 0,1.1
1206 = smd 1.6 x 1.8: 1 -1.4,0; 2 1.4,0
0603-RES = smd 1.1 x 1: 1 -0.85,0; 2 0.85,0
0402-RES = smd 0.7 x 0.9: 1 -0.65,0; 2 0.65,0
0805 = smd 0.8 x 1.2: 1 -0.9,0; 2 0.9,0
LTSTS220KGKT = smd 1 x 1.5: 1 0,1.25; 2 0,-1.25
SOT26-PNP = smd 0.55 x 0.8: B1 0,-1.2; B2 0.95,-1.2; C1 -0.95,-1.2; C2 0.95,1.2; E1 -0.95,1.2; E2 0,1.2
QFN-44 = smd 0.8 x 0.3: 1 -3.4,2.5; 2 -3.4,2; 3 -3.4,1.5; 4 -3.4,1; 5 -3.4,0.5; 6 -3.4,0; 7 -3.4,-0.5; 8 -3.4,-1; 9 -3.4,-1.5; 10 -3.4,-2; 11 -3.4,-2.5; 23 3.4,-2.5; 24 3.4,-2; 25 3.4,-1.5; 26 3.4,-1; 27 3.4,-0.5; 28 3.4,0; 29 3.4,0.5; 30 3.4,1; 31 3.4,1.5; 32 3.4,2; 33 3.4,2.5 | smd 0.3 x 0.8: 12 -2.5,-3.4; 13 -2,-3.4; 14 -1.5,-3.4; 15 -1,-3.4; 16 -0.5,-3.4; 17 0,-3.4; 18 0.5,-3.4; 19 1,-3.4; 20 1.5,-3.4; 21 2,-3.4; 22 2.5,-3.4; 34 2.5,3.4; 35 2,3.4; 36 1.5,3.4; 37 1,3.4; 38 0.5,3.4; 39 0,3.4; 40 -0.5,3.4; 41 -1,3.4; 42 -1.5,3.4; 43 -2,3.4; 44 -2.5,3.4
RESONATOR-SMD-3.2X1.3 = smd 0.45 x 1.905: 1 -1.2,0; 2 0,0; 3 1.2,0

### Placement (x,y rotation side)
C1  30.95,46.85 180 bottom
C2  30.85,38.35 180 bottom
C3  20.4,6.1 270 bottom
D1  76.65,57.5 0 top
D2  57.15,57.5 0 top
D3  47.2,57.5 0 top
D4  25.85,57.5 180 top
IC1  30.8,42.5 0 bottom
J1  101.25,33.05 0 top
J2  74.5,33.05 0 top
J3  47.75,33.05 0 top
J4  21,33.05 0 top
J5  57.5,7.3 0 top
JP1  89.35,4.7 0 top
JP2  10.75,12.2 90 top
JP3  28,4.75 0 top
JP4  4,6.25 180 top
JP5  99.5,6.25 180 top
JTAG1  5,30.75 270 top
K1  93.6,38 270 top
K2  67,38 270 top
K3  39.85,38 270 top
K4  14.2,38 270 top
Q1  59.91,22.15 0 bottom
Q2  85.25,55.85 90 top
Q3  60.35,52.55 270 top
Q4  44.6,53.25 90 top
Q5  18.95,53.3 90 top
R1  73.44,6.65 0 bottom
R2  73.5,10.95 0 bottom
R3  85.35,35.65 90 top
R4  82.4,35.7 90 top
R5  36.75,28.45 90 top
R6  32.2,28.5 90 top
R7  87.1,29.5 90 top
R8  82.35,29.5 90 top
R9  78,8.1 90 top
R10  80.05,8.1 90 top
R11  19.8,10.1 180 top
R12  19.85,12.2 0 top
R13  99.8,54.65 0 top
R14  103.65,54.55 0 top
R15  15.15,5.3 270 top
R16  13,5.35 270 top
R17  38.85,32.5 270 top
R18  34.7,32.45 270 top
STATUS  102.95,60.25 270 top
TX/RX  95.85,60.25 270 top
U1  67.85,9.63 0 bottom
U$1  33.6,13.75 45 top
Y2  38.7,8.1 45 top

### Tracks (layer width: path | path; a pad name or v marks a point on that pad's centre or on a via)
3.3V
  Bottom 0.127: JP1.9 94.45,3.49 94.45,3.73 99.94,9.21 99.94,45.88 98.8,47.02 J1.P$1
5V
  Top 0.127: D4.C 28.22,57.44 38.35,57.44 39.84,55.94 K3.1 40.01,55.94 41.5,57.44 44.82,57.44 D3.C 44.99,57.6 46.48,59.1 50.96,59.1 52.46,57.6 54.78,57.6 D2.C | D1.C 74.2,57.44 68.56,57.44 67.06,55.94 K2.1
  Bottom 0.127: U1.E2 67.89,10.96 67.89,14.11 70.22,16.43 70.4,16.9 | K1.1 93.46,55.78 93.46,54.78 92.46,53.78 92.46,46.81 93.29,45.98 K1.5 | 35.61,49.88 30.69,49.88 30.68,49.88 29.55,48.75 C1.1 | K4.1 14.28,55.78 14.28,54.78 15.44,53.62 15.44,46.98 14.44,45.98 K4.5 | K2.1 66.9,55.78 66.9,54.78 65.9,53.78 65.9,46.81 66.73,45.98 K2.5 | 35.61,49.88 35.61,51.54 K3.1 | 34.22,45.62 36.2,47.6 36.2,49.35 35.67,49.88 35.61,49.88 | IC1.3 33.05,41.55 33.5,42 33.5,42.85 32.9,43.45 IC1.1
  Bottom 0.152: 69.3,43.22 69.3,43.32
  Bottom 0.508: IC1.1 34.22,45.62 K3.5
  Bottom 1.016: 69.45,43.07 69.3,43.22 | 70.4,16.9 92.5,16.9 95.95,20.35 95.95,39 93.6,41.35 K1.5 | K4.5 14.2,43.7 16.8,41.1 16.8,16.2 18.45,14.55 43.85,14.55 42.6,15.8 42.6,39.8 42.6,42.87 K3.5
  Bottom 1.27: 69.3,31.8 68.8,31.3 68.8,22.16 68.8,18.5 69.3,18 70.4,16.9 | 43.85,14.55 45.73,16.43 49.79,16.43 50.24,16.43 52,18.19 52,31.2 52.6,31.8 69.3,31.8 | 69.3,43.32 K2.5 | 69.45,43.07 69.3,42.92 69.3,31.8
  Bottom 2.54: Q1.3 57.37,16.8 60.01,19.43 66.07,19.43 68.8,22.16
5V_PWR_1
  Top 0.127: 93.62,38.01 K1.8 | 103.65,47.02 J1.P$2 | 103.65,44.48 J1.P$4 103.62,44.43 103.59,44.42
  Top 0.406: 93.62,38.01 94.25,38.01 96.92,40.69 98.95,40.69 99.85,40.69 103.59,44.42 | 103.65,47.02 103.65,44.48
5V_PWR_2
  Top 0.127: 67.06,38.01 K2.8 | 76.91,47.02 J2.P$2 | 76.91,44.48 J2.P$4
  Top 0.406: 67.06,38.01 67.06,40.85 69.39,43.18 74.72,43.18 75.67,43.18 76.93,44.44 J2.P$4 | 76.91,47.02 76.91,44.48
5V_PWR_3
  Top 0.127: 40.01,38.01 K3.8
  Top 0.406: 40.01,38.01 41.08,38.01 43.71,40.64 45.45,40.64 46.38,40.64 46.38,40.69 J3.P$4 J3.P$2
5V_PWR_4
  Top 0.127: 14.28,38.01 K4.8 | 23.41,46.98 J4.P$2 | 23.41,44.49 J4.P$4 23.41,44.32
  Top 0.406: 14.28,38.01 15.3,38.01 17.98,40.69 19.77,40.69 23.41,44.32 | 23.41,46.98 23.41,44.49
ADDR_1  (via drill 0.3)
  Top 0.127: v28.72,13.45 29.05,13.11 29.38,13.11 U$1.1 | v55.61,5.48 82.17,5.48 84.16,3.49 JP1.1
  Bottom 0.127: v28.72,13.45 47.64,13.45 v55.61,5.48
ADDR_2  (via drill 0.3)
  Top 0.127: v35.52,7.97 34.36,9.13 34.36,9.46 U$1.12
  Bottom 0.127: v35.52,7.97 39.84,7.97 45.48,2.32 85.66,2.32 86.65,3.32 JP1.3
D+
  Top 0.152: R11.1 21.2,10.85 29.22,10.85 29.29,10.85 U$1.4
D-
  Top 0.152: R12.2 21.4,11.3 29.03,11.3 U$1.3
GND  (via drill 0.3, 0.35)
  Top 0.127: 37.02,4.81 36.69,5.15 | 36.69,5.15 36.52,5.31 36.52,9.46 35.36,10.62 U$1.15 | 93.59,57.41 93.62,57.44 100.39,50.67 100.39,44.14 99.34,43.09 97.04,43.09 92.46,38.51 92.46,37.52 93.13,36.85 97.77,36.85 J1.P$9 | 93.59,57.41 93.13,56.94 86.32,56.94 Q2.2 86.15,56.94 82.5,56.94 80.34,59.1 58.1,59.1 57.93,58.93 57.93,52.29 58.76,51.46 | J1.P$6 103.68,41.7 98.94,36.97 98.94,36.98 J1.P$9 | J1.P$20 103.83,24.16 104.75,25.08 104.75,30.76 103.73,31.78 J1.P$14 103.63,31.78 98.89,36.52 98.89,36.79 J1.P$9 | U$1.5 26.11,6.97 25.07,6.97 24.51,6.42 24.51,5.62 25.46,4.67 JP3.1 | v36.85,5.31 36.69,5.15 | v51.75,12.31 49.78,14.28 37.85,14.28 U$1.23 | v54.12,7.8 53.45,7.14 39.67,7.14 39.7,7.1 | JTAG1.3 3.65,33.2 3.32,32.87 3.32,31.54 3.65,31.21 3.65,30.88 JTAG1.5 3.82,30.71 3.82,30.38 5.15,29.05 5.15,23.41 12.28,16.27 | 12.28,16.27 22.24,16.27 | 22.24,16.27 28.22,16.27 29.71,14.77 U$1.43 | 12.28,16.27 10.79,14.77 JP2.3 | U$1.35 32.54,17.6 26.06,24.07 23.57,24.07 J4.P$20 | 25.07,52.12 25.07,43.49 23.57,42 J4.P$6 23.41,41.83 18.59,37.02 J4.P$9 | 25.07,52.12 25.07,58.93 24.9,59.1 22.08,59.1 20.09,57.1 20.09,54.28 Q5.2 | J2.P$20 | J2.P$20 76.56,24.19 76.56,24.28 74.47,26.38 74.47,29.41 76.81,31.76 76.91,31.76 J2.P$14 | J2.P$6 76.93,41.78 72.02,36.87 J2.P$9 71.05,36.85 55.26,36.85 J3.P$6 50.18,41.96 45.12,36.9 J3.P$9 45.24,36.85 50.14,31.95 50.14,31.82 J3.P$14 50.18,31.85 48.14,29.81 48.14,26.23 49.18,25.19 J3.P$20 | 58.76,51.46 59.26,51.46 Q3.2 | 58.76,51.46 58.32,51.01 48.75,51.01 45.65,54.12 | 25.07,52.12 43.66,52.12 45.65,54.12 | 45.65,54.12 Q4.2 | v22.24,19.92 22.24,16.27
  Top 0.127: 93.59,57.41 93.59,59.24 TX/RX.2 95.45,61.1 100.85,61.1 STATUS.2
  Top 0.152: 37.02,4.81 37.96,4.81 39.7,6.55 39.7,7.1 Y2.2 | 76.91,31.76 80.02,28.65 R8.1 82.45,28.65 v83.65,27.45 | R7.1 87.1,27.65 v86.65,27.2 | R17.1 38.95,33.45 | 38.95,33.45 42.4,36.9 45.12,36.9 | R18.1 v34.7,35.25 | v38.85,35.25 38.85,33.55 38.95,33.45 | JP4.2 9.15,3.1 v16.7,3.1
  Bottom 0.127: J1.P$20 102.59,24.07 100.37,21.85 100.37,7.38 JP5.2 | v36.85,5.31 31.21,5.31 30.38,4.48 26.85,4.48 25.85,3.48 JP3.1 24.24,4.7 C3.2 | J5.GND@2 57.56,9.46 54.6,9.46 v51.75,12.31 52.52,11.54 52.52,9.4 v54.12,7.8 | 74.84,5.44 74.87,6.14 74.87,6.64 R1.1 74.87,6.81 74.87,10.79 R2.1 | JP2.3 10.62,14.61 6,9.99 6,7.3 JP4.2 | 24.57,42.99 23.57,42 J4.P$6 | J4.P$9 18.43,36.85 23.41,31.87 J4.P$14 23.57,31.71 24.57,30.71 24.57,26.23 23.57,25.23 23.57,24.24 J4.P$20 23.41,24.07 22.24,22.91 v22.24,19.92 | J2.P$14 71.86,36.86 J2.P$9 | 30.55,42.45 30.55,45.05 | IC1.2 32,42.45 30.55,42.45 | C2.2 30.55,40.05 30.55,42.45
  Bottom 0.152: C1.2 30.55,45.05 26.62,45.05 24.57,42.99 | v86.65,27.2 83.9,27.2 v83.65,27.45 | v38.85,35.25 v34.7,35.25 32.25,37.7 C2.2 | v16.7,3.1 18.8,3.1 C3.2
  Bottom 1.67: J5.GND@2 66.35,3.95 73.35,3.95 74.84,5.44
  pour Bottom: 0.1,62.4 106.9,62.4 106.9,0.1 0.1,0.1
  pour Top: 0.1,62.4 106.9,62.4 106.9,0.1 0.1,0.1
MISO  (via drill 0.35)
  Top 0.127: U$1.11 32.87,9.46 32.45,9.04 32.45,7.92 v32.47,7.9
  Bottom 0.127: v32.47,7.9 30.59,6.02 JP3.6
MONITOR_1  (via drill 0.3, 0.35)
  Top 0.127: U$1.21 37.47,12.76 41.43,8.8 73.04,8.8 v80.01,15.77
  Top 0.152: J1.P$15 100.95,31.37 100.95,32.6 100.5,33.05 95.3,33.05 v94.15,31.9 | v89.2,31.35 88.1,31.35 R7.2
  Bottom 0.127: v80.01,15.77 92.63,15.77 97.28,20.42 97.28,28.72 97.77,29.22 J1.P$15
  Bottom 0.152: v94.15,31.9 93.6,31.35 v89.2,31.35
MONITOR_2
  Top 0.127: U$1.26 36.85,15.6 37.85,16.6 66.73,16.6 69.89,19.75 69.89,28.05 71.05,29.22 J2.P$15
  Top 0.152: 71.05,29.22 70.2,30.06 70.2,32.3 70.95,33.05 79.65,33.05 R8.2
MONITOR_3
  Top 0.127: 42.83,27.72 42.83,23.74 35.69,16.6 U$1.29 | 42.83,27.72 44.32,29.22 J3.P$15 | 42.83,27.72 39.01,31.54 R17.2
MONITOR_4
  Top 0.127: 18.92,29.71 18.59,29.38 J4.P$15 18.92,29.71 | 18.92,29.71 22.23,33.02 30.42,33.02 35.03,28.42 35.03,17.93 34.69,17.6 U$1.32 | 18.92,29.71 17.43,31.21 17.43,32.2 18.09,32.87 18.59,32.87 19.75,34.03 19.75,34.69 23.07,38.01 28.55,38.01 34.86,31.71 R18.2
MOSI
  Top 0.127: U$1.10 32.54,9.79 31.87,9.13 31.87,3.32 30.7,2.15 30.05,2.15 29.25,2.95 29.25,4.1 28.6,4.75 26.79,4.75 25.52,6.02 JP3.2
N$1  (via drill 0.35)
  Top 0.127: v29.8,8.45 29.8,9.95 U$1.6
  Bottom 0.127: C3.1 21.35,8.45 v29.8,8.45
N$2
  Top 0.127: R14.2 104.55,59.9 STATUS.1
N$3
  Top 0.127: Q2.1 86.32,54.78 86.32,54.21 90.8,49.73 90.8,41.95 R3.2
N$4
  Top 0.127: D1.A 79.02,57.44 80.51,55.94 84,55.94 Q2.3 84.16,55.78 86.65,55.78 89.14,53.29 93.46,53.29 K1.2
N$5
  Top 0.127: Q4.1 45.48,52.29 45.48,50.13 41,45.65 41,40.84 36.75,36.58 R5.2
N$6
  Top 0.127: R13.2 100.7,56.65 TX/RX.1
N$8
  Top 0.127: Q5.1 19.92,52.29 19.92,50.3 15.44,45.82 15.44,40.84 12.95,38.35 12.95,33.37 18.43,27.89 28.45,27.89 29.31,28.75 31.6,28.75 R6.2
N$10
  Top 0.127: JP1.10 94.45,5.98 95.78,7.31 102.06,7.31 102.54,6.83 102.54,4.43 98.94,0.83 22.87,0.83 19.25,4.45 R15.2 15.1,4.5 R16.2
N$11
  Bottom 0.127: U1.B2 67.06,8.47 67.73,8.47 U1.B1 67.89,8.47 68.72,8.47 U1.C1 68.89,8.3 70.38,8.3 71.88,6.81 R1.2
N$15
  Bottom 0.127: R2.2 72.04,10.79 71.38,10.13 67.4,10.13 67.06,10.46 67.06,10.79 U1.C2 66.9,10.96 66.9,12.78 62.58,17.1 Q1.1
N$16
  Top 0.127: 61.59,52.62 66.4,52.62 66.9,53.12 K2.2 | 61.59,52.62 59.59,54.61 59.59,57.44 D2.A | 61.59,52.62 Q3.3
N$18
  Top 0.127: R9.1 78.02,7.3 79.02,7.3 80.34,5.98 84.16,5.98 JP1.2
N$19
  Top 0.127: R10.1 80.18,7.3 85.32,7.3 86.65,5.98 JP1.4
N$21
  Top 0.127: 43.33,53.29 40.01,53.29 K3.2 | 43.33,53.29 43.49,53.29 Q4.3 43.33,53.29 | 43.33,53.29 44.99,54.95 45.32,54.95 47.81,57.44 49.47,57.44 D3.A
N$22
  Top 0.127: K4.2 14.28,53.29 17.76,53.29 Q5.3 17.93,53.45 20.42,53.45 23.41,56.44 23.41,57.44 D4.A
N$35
  Top 0.127: Q3.1 59.43,53.45 60.59,52.29 60.59,52.12 64.57,48.14 77.71,48.14 79.6,46.25 79.6,39.35 R4.2
N$36
  Top 0.127: R11.2 19.09,10.13 19.05,10.1
  Top 0.152: 19.05,10.1 18.3,10.85 11.64,10.85 10.75,9.96 JP2.1
N$38
  Top 0.152: JP2.2 11.65,11.3 18.3,11.3 R12.1
RELAY_1
  Top 0.127: U$1.22 37.85,13.11 49.97,13.11 53.93,9.15 53.93,9.13 62.2,9.13 68.75,15.68 68.75,15.9 69.05,16.2 79.28,16.2 85.35,22.27 R3.1
RELAY_2
  Top 0.127: U$1.27 36.52,15.94 38.01,17.43 53.36,17.43 71.5,35.57 81.68,35.57 R4.1
RELAY_3
  Top 0.127: U$1.30 35.36,16.93 36.75,18.32 R5.1
RELAY_4
  Top 0.127: U$1.33 34.2,17.93 34.2,25.65 R6.1
RESET  (via drill 0.3)
  Top 0.127: v35.19,9.13 35.19,9.3 34.69,9.79 U$1.13
  Bottom 0.127: 32.02,9.13 13.61,9.13 9.23,4.75 3.61,4.75 2.93,5.43 2.93,7.5 7.39,11.97 7.39,24.55 JTAG1.10 | 32.02,9.13 v35.19,9.13 | JP3.4 29.63,7.65 30.55,7.65 32.02,9.13
SCK
  Top 0.127: U$1.9 32.2,10.13 31.54,9.46 31.54,4.48 JP3.5
SCL  (via drill 0.3)
  Top 0.127: v37.85,10.46 37.52,10.46 36.85,11.12 36.85,11.29 36.52,11.62 U$1.18 | R16.1 12.8,6 8.25,6 JP4.3
  Bottom 0.127: JP4.3 9.74,6.25 13.94,10.46 v37.85,10.46 45.48,2.82 73.87,2.82 75.53,4.48 89.31,4.48 90.64,5.81 91.8,5.81 JP1.8 91.96,5.81 91.96,4.81 93.46,3.32 93.46,2.99 94.12,2.32 97.09,2.32 99.5,4.73 JP5.1
SCL_JUMP
  Top 0.127: J1.P$5 101.67,44.78 101.67,46.8 103.01,48.14 104.44,48.14 105.33,47.24 105.33,18.92 93.06,6.65 93.06,4.32 JP1.7
SDA  (via drill 0.3, 0.35)
  Top 0.127: 89.47,4.81 89.47,5.81 JP1.6 | 89.47,4.81 90.8,3.49 90.8,3.15 91.63,2.32 98.75,2.32 v99.84,3.41 | v37.52,11.29 36.85,11.95 U$1.19 | 89.47,4.81 86.82,4.81 85.52,3.52 85.52,3.19 83.5,1.16 23.13,1.16 17.95,6.34 15.46,6.34 R15.1 14.27,7.44 5.45,7.44 4.27,6.25 JP4.1
  Bottom 0.127: v37.52,11.29 14.28,11.29 10.19,7.21 7.62,7.21 7,6.58 7,5.6 6.53,5.13 5.12,5.13 JP4.1 | v99.84,3.41 100.66,3.41 JP5.3
SDA_JUMP  (via drill 0.3)
  Top 0.127: v90.8,4.81 90.8,22.08 92.96,24.24 92.96,36.52 92.13,37.35 92.13,38.68 98.02,44.57 98.04,44.48 J1.P$3
  Bottom 0.127: v90.8,4.81 89.47,3.49 JP1.5
SHUTDOWN_1  (via drill 0.3)
  Top 0.127: v90.14,25.07 73.54,8.47 41.17,8.47 37.68,11.95 37.52,11.95 37.18,12.28 U$1.20 | v94.79,29.71 95.78,29.71 97.77,31.71 J1.P$13
  Bottom 0.127: v94.79,29.71 v90.14,25.07
SHUTDOWN_2
  Top 0.127: U$1.25 37.18,15.11 37.68,15.6 37.68,15.77 38.18,16.27 68.23,16.27 69.89,17.93 72.93,17.93 73.86,18.86 73.86,23.07 73.86,30.31 72.41,31.76 72.41,31.78 J2.P$13
SHUTDOWN_3
  Top 0.127: U$1.28 36.02,16.27 43.16,23.41 43.16,27.06 44.16,28.05 46.15,28.05 47.05,28.95 47.05,30.05 J3.P$13
SHUTDOWN_4
  Top 0.127: U$1.31 35.03,17.26 35.56,17.8 35.56,28.58 32.7,31.45 28.53,35.61 22.33,35.61 18.59,31.87 J4.P$13
STATUS
  Top 0.127: U$1.40 30.71,15.94 23.9,22.74 15.94,22.74 12.62,26.06 12.62,53.29 13.94,54.61 17.1,54.61 23.97,61.48 102.32,61.48 102.75,61.06 R14.1
TCK  (via drill 0.3)
  Top 0.127: v13.28,26.23 16.43,23.07 24.24,23.07 31.04,16.27 U$1.39
  Bottom 0.127: v13.28,26.23 6.31,33.2 JTAG1.4
TDI  (via drill 0.3)
  Top 0.127: v29.22,18.92 30.71,18.92 31.87,17.76 31.87,17.6 32.2,17.26 U$1.36 | v19.09,17.76 18.43,17.1 17.26,17.1 6.31,28.05 JTAG1.8
  Bottom 0.127: v29.22,18.92 24.73,18.92 23.57,17.76 v19.09,17.76
TDO  (via drill 0.3)
  Top 0.127: v31.21,17.6 31.87,16.93 U$1.37 | v26.39,17.6 23.41,20.58 16.43,20.58 6.31,30.71 JTAG1.6
  Bottom 0.127: v26.39,17.6 v31.21,17.6
TMS  (via drill 0.3)
  Top 0.127: v29.88,18.26 29.88,18.09 31.04,16.93 31.21,16.93 31.54,16.6 U$1.38 | v18.26,17.76 6.31,29.71 5.81,29.71 5.15,30.38 5.15,34.69 6.14,35.69 JTAG1.2
  Bottom 0.127: v29.88,18.26 24.57,18.26 23.41,17.1 18.92,17.1 v18.26,17.76
TX/RX  (via drill 0.3)
  Top 0.127: v24.9,20.92 25.07,20.92 30.38,15.6 U$1.41 | R13.1 98.9,55.48 v96.45,57.93
  Bottom 0.127: v24.9,20.92 24.9,39.51 23.57,40.84 22.91,40.84 22.24,41.5 22.24,48.14 32.04,57.93 v96.45,57.93
VCC  (via drill 0.3)
  Top 0.127: 36.19,5.15 36.19,8.96 35.03,10.13 U$1.14 | 36.19,5.15 37.02,4.32 53.62,4.32 57.44,8.13 77.36,8.13 77.85,8.63 R9.2 78.02,8.8 80.01,8.8 R10.2 | 28.05,13.45 28.05,13.61 28.72,14.28 | 28.05,13.45 28.05,13.28 28.88,12.45 29.38,12.45 29.55,12.62 29.71,12.62 U$1.2 | 28.72,14.28 29.38,14.28 U$1.44 | v32.87,23.9 32.87,17.93 U$1.34 | v38.35,15.6 37.52,14.77 U$1.24 | 28.72,14.28 28.72,14.94 v28.05,15.6 | 10.13,13.61 10.29,13.45 28.05,13.45 | 10.13,13.61 2.66,21.08 2.66,33.7 3.65,34.69 3.65,35.69 JTAG1.1 | 36.19,5.15 34.69,5.15 31.04,1.49 29.3,1.49 | 29.3,1.49 23.4,1.49 16.59,8.3 10.29,8.3 9.46,9.13 9.46,12.95 10.13,13.61 | JP3.3 28,2.79 29.3,1.49
  Bottom 0.127: v28.05,15.6 v38.35,15.6 38.35,18.43 v32.87,23.9 32.87,24.4 30.54,26.73 30.54,37.35 29.54,38.35 C2.1 27.9,39.9 27.9,42.75 28.6,43.45 IC1.5
VCC_IN
  Bottom 0.127: U1.E1 68.89,10.96 69.89,10.96 71.21,12.28 72.87,12.28 73.21,11.95 73.21,9.96 72.87,9.63 62.75,9.63 60.09,12.28 56.88,12.28 J5.VCC@2
  Bottom 2.54: J5.VCC@2 55.7,11.84 54.23,13.31 54.23,20.22 Q1.2
XTAL1
  Top 0.152: Y2.3 38.86,8.95 38.48,9.33 38.02,9.33 U$1.17
XTAL2
  Top 0.152: Y2.1 37.85,7.91 37.55,8.2 37.55,9.09 U$1.16

### Text on the board
tPlace: CSPB / v1.1 | +5V | + | -
tNames: GND | D- | D+ | SDA | GND | SCL | ADDR_1 | ADDR_2 | SDA | SCL | 3.3V | SCL | GND | SDA